# EAGLE design audio_mux_stereo_eurorack (EAGLE 9.1.3)
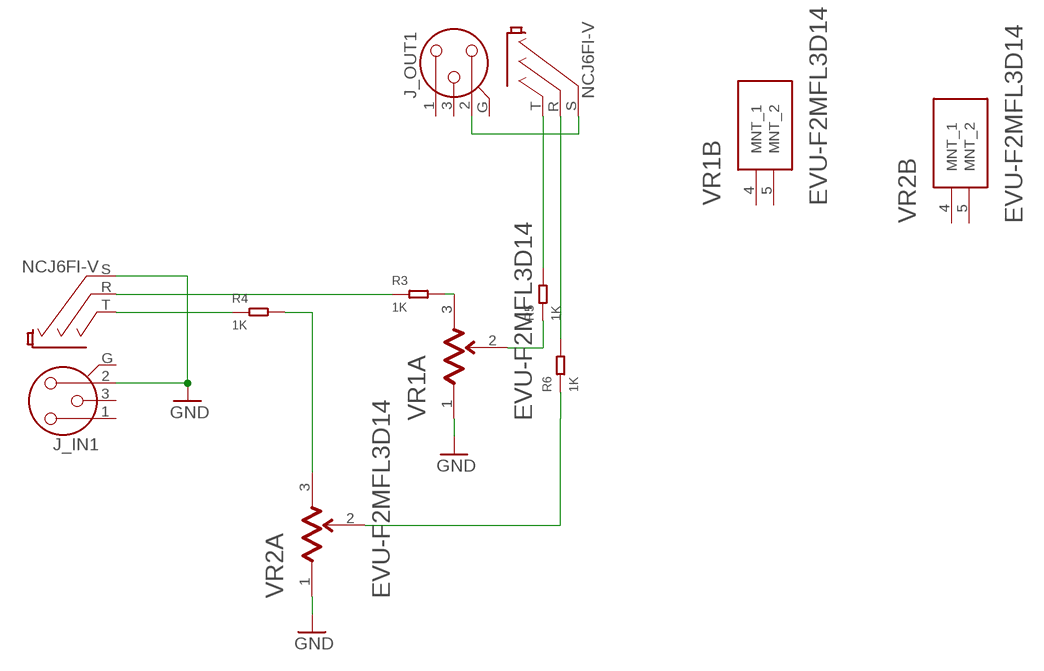
[diagram p0: schematic, sheet 1]

## Parts
J_IN1  NCJ6FI-V  [NCJ6FI-V]
J_OUT1  NCJ6FI-V  [NCJ6FI-V]
R3  1K  SMD-RES-0.1R-5%-1/8W(0805)  [R0805]
R4  1K  SMD-RES-0.1R-5%-1/8W(0805)  [R0805]
R5  1K  SMD-RES-0.1R-5%-1/8W(0805)  [R0805]
R6  1K  SMD-RES-0.1R-5%-1/8W(0805)  [R0805]
VR1  PANASONIC_EVU-F2MFL3D14PANASONIC_EVU-F2MFL3D14_0_0  [PANASONIC_EVU-F2MFL3D14_0]
VR2  PANASONIC_EVU-F2MFL3D14PANASONIC_EVU-F2MFL3D14_0_0  [PANASONIC_EVU-F2MFL3D14_0]

## Nets
GND: J_IN1.2 J_IN1.S VR1.1 VR2.1
N$1: J_OUT1.R R6.2
N$2: J_OUT1.2 J_OUT1.S
N$3: J_IN1.R R3.1
N$4: J_IN1.T R4.1
N$5: R3.2 VR1.3
N$6: R4.2 VR2.3
N$7: R5.1 VR1.2
N$8: R6.1 VR2.2
N$10: J_OUT1.T R5.2
Unconnected: J_IN1.1 J_IN1.3 J_IN1.G J_OUT1.1 J_OUT1.3 J_OUT1.G VR1.4(B:MNT_1) VR1.5(B:MNT_2) VR2.4(B:MNT_1) VR2.5(B:MNT_2)

## Library data of the parts
J_IN1 J_OUT1 = con-neutrik_xlr_2:NCJ6F: NCJ6F Combination - 3 pin Female XLR - 3 pin 1/4" socket With or without retention latch I variant Combi I series A varaiant Combi A series reduced width 2 x T pins Source: www.neutrik.com/
R3-R6 = Seeed-Resistor:SMD-RES-0.1R-5%-1/8W(0805): 301010264; MPN: RL0805JR-070R1L; VALUE: 0.1R
VR1 VR2 = Panasonic - EVU-F2MFL3D14:PANASONIC_EVU-F2MFL3D14: Square Rotary Potentiometers with Insulated Shaft; CENTROID_NOT_SPECIFIED: Yes; DATASHEET: https://upverter.com/datasheet/0e6f35378f82932eabea89c93832ce37004881c1.pdf; DIGIKEY_DESCRIPTION: RES POT 10K OHM 1/20W LOGARITHMIC; DIGIKEY_PART_NUMBER: P3H8103-ND; LEAD_FREE: yes; MF: Panasonic; MOUSER_PART_NUMBER: 667-EVU-F2MFL3D14; MPN: EVU-F2MFL3D14; PACKAGE: PTH_POT_12MM5_9MM7; POWER: 50mW; PREFIX: VR; RESISTANCE: 10kΩ; ROHS: yes

## Board
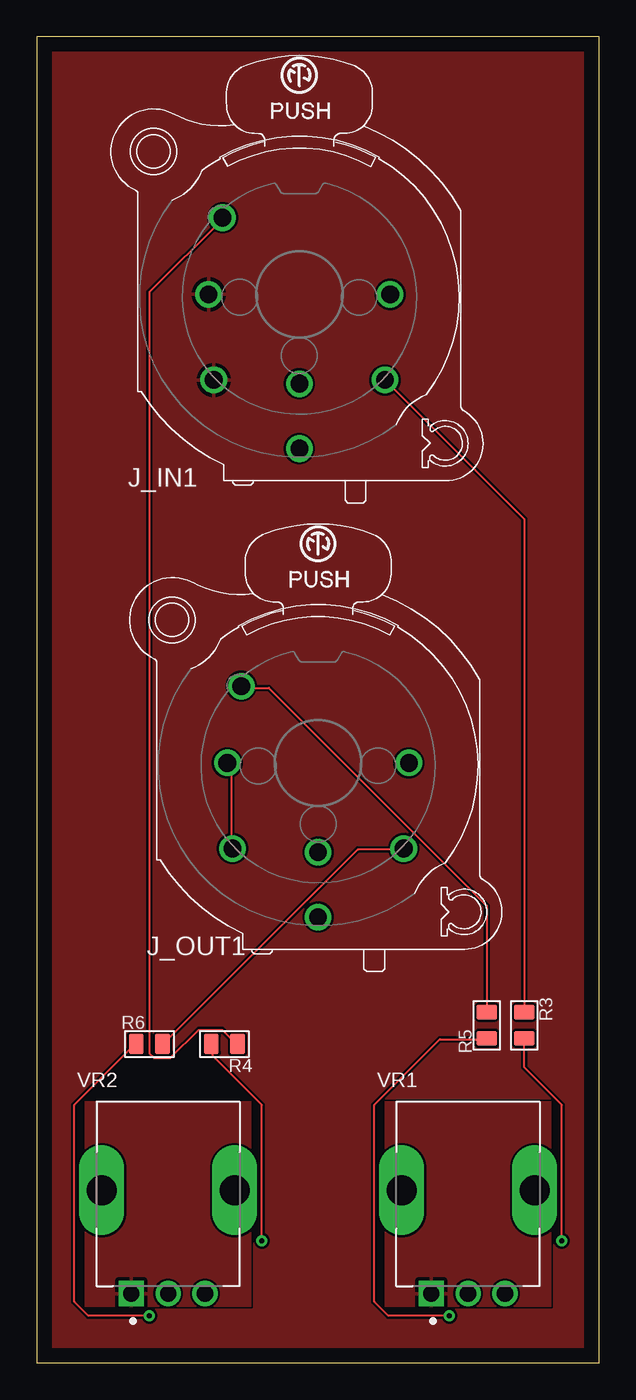
[diagram p1: board, top side]
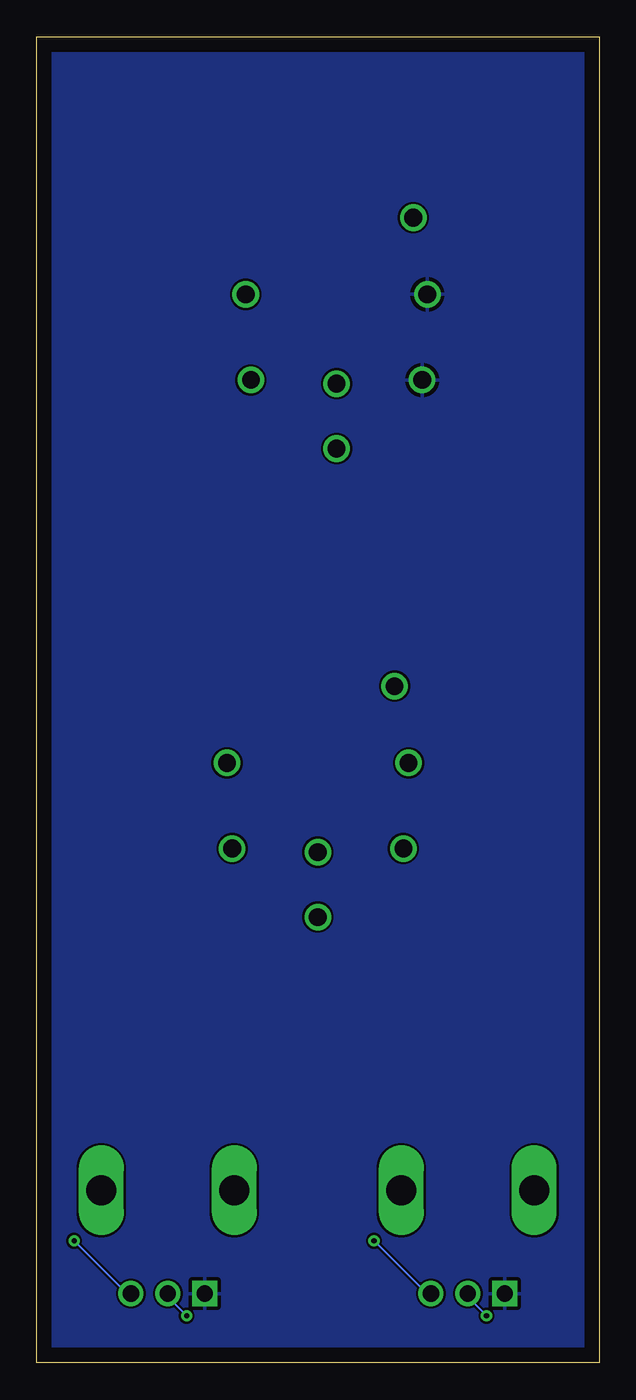
[diagram p2: board, bottom side, seen from below]

Size 38.08 x 89.84 mm. Coordinates in mm from the lower left corner, seen from the top.
Outline: 0,0 38.08,0 38.08,89.84 0,89.84 0,0
Copper layers (1*16): Top 0.035mm / dielectric 1.5mm / Bottom 0.035mm
Design rules "default": minimum track width 6mil, minimum drill 0.35mm, track to track 6mil, track to pad 6mil, pad to pad 6mil, via to via 6mil, smd to smd 6mil, copper to edge 40mil, drill to drill 6mil, minimum pad ring 10mil, minimum via ring 8mil, stop-mask expansion 4mil, vias tented up to drill 0mil, thermal gap 10mil

### Footprints (pad centres in the part's own frame; a part is rotated, then mirrored left to right if it is on the bottom)
NCJ6FI-V = drill 1.2: 1 6.15,0; 2 -6.15,0; 3 0,-6.05; G 0,-10.45; R 5.8,-5.8; S -5.8,-5.8; T -5.2,5.2
R0805 = smd 1.397 x 1.016: 1 0,0.889; 2 0,-0.889
PANASONIC_EVU-F2MFL3D14_0 = drill 1.1 pad 1.7 square: 1 -2.5,-6.75 | drill 1.1 pad 1.7: 2 0,-6.75; 3 2.5,-6.75 | drill 2.032 pad 2.286 long: 4 -4.5,0.25; 5 4.5,0.25

### Placement (x,y rotation side)
J_IN1  17.78,72.39 0 top
J_OUT1  19.05,40.64 0 top
R3  33.02,22.86 0 top
R4  12.7,21.59 270 top
R5  30.48,22.86 180 top
R6  7.62,21.59 90 top
VR1  29.21,11.43 0 top
VR2  8.89,11.43 0 top

### Tracks (layer width: path | path; a pad name or v marks a point on that pad's centre or on a via)
GND
  pour Top: -6.35,91.44 43.18,91.44 43.18,0 40.64,-2.54 39.37,-3.81 2.54,-3.81 -6.35,5.08
  pour Bottom: -12.7,83.82 0,96.52 1.27,96.52 33.02,96.52 35.56,93.98 50.8,78.74 50.8,72.39 50.8,7.62 35.56,-7.62 5.08,-7.62 -6.35,3.81 -6.35,76.2 -13.97,83.82
N$1
  Top 0.152: R6.2 8.57,21.59 21.75,34.77 24.77,34.77 J_OUT1.R
N$2
  Top 0.152: J_OUT1.S 13.18,34.93 13.18,40.48 13.02,40.64 J_OUT1.2
N$3
  Top 0.152: R3.1 33.02,23.81 33.02,57.15 23.65,66.52 J_IN1.R
N$4
  Top 0.152: R4.1 13.49,21.59 12.54,22.54 10.95,22.54 9.05,20.64 7.94,20.64 7.62,20.95 7.62,72.55 12.54,77.47 J_IN1.T
N$5  (via drill 0.35)
  Top 0.152: v35.56,8.26 35.56,17.46 33.02,20 33.02,21.91 R3.2
  Bottom 0.152: v35.56,8.26 32.07,4.76 31.75,4.76 VR1.3
N$6  (via drill 0.35)
  Top 0.152: v15.24,8.26 15.24,17.46 11.91,20.8 11.91,21.59 R4.2
  Bottom 0.152: v15.24,8.26 11.75,4.76 11.43,4.76 VR2.3
N$7  (via drill 0.35)
  Top 0.152: v27.94,3.18 23.81,3.18 22.86,4.13 22.86,17.46 27.3,21.91 30.48,21.91 R5.1
  Bottom 0.152: v27.94,3.18 29.21,4.45 29.21,4.6 VR1.2
N$8  (via drill 0.35)
  Top 0.152: v7.62,3.18 3.49,3.18 2.54,4.13 2.54,17.46 6.67,21.59 R6.1
  Bottom 0.152: v7.62,3.18 8.89,4.45 8.89,4.6 VR2.2
N$10
  Top 0.152: R5.2 30.48,23.81 30.48,30.96 15.72,45.72 13.97,45.72 J_OUT1.T